# Altium project Soldeerbout.PrjPcb
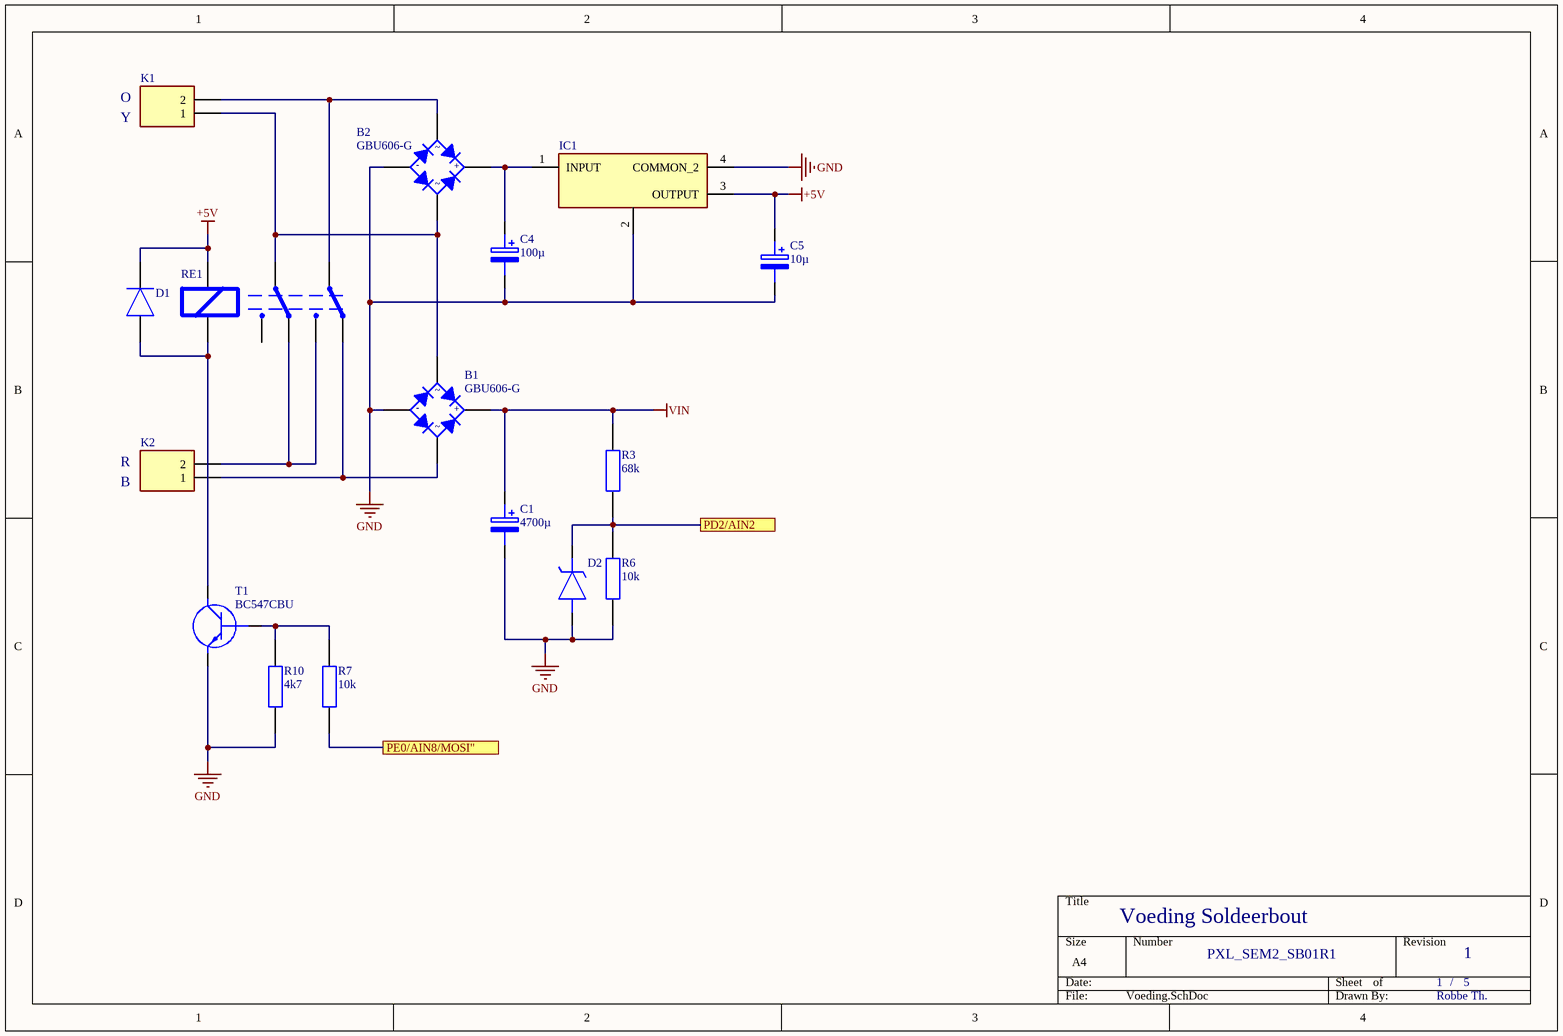
[diagram p0: Voeding.SchDoc]
5 sheets, 74 parts. Net scope: flat (ports and power ports of the same name join across sheets).
Board file: PCB1.PcbDoc
Sheets:
  Voeding.SchDoc
  Heater_Driver.SchDoc
  Temp_Sensing.SchDoc
  Logic.SchDoc
  Display.SchDoc

## Sheet Voeding.SchDoc: Voeding Soldeerbout
size A4; Date: 18/02/2022; Author: Robbe Th.; CompanyName: R-CyberSolutions; DrawnBy: Robbe Th.; Organization: R-CyberSolutions; DocumentNumber: 1/1; Revision: 1; SheetNumber: 1; SheetTotal: 5; Number: PXL_SEM2_SB01R1

### Parts
B1  GBU606-G  [GBU606G]
B2  GBU606-G  [GBU606G]
C1  4700µ  [CAPPRD750W80D1850H4150]
C4  100µ  [CAPPRD350W60D825H1300]
C5  10µ  [CAPPRD200W52D500H1250]
D1  FM4007W-W  [DIOM5025X231N]  (value not drawn)
D2  MMSZ4689T1G  [SOD3716X135N]  (value not drawn)
IC1  TL780-05CKTTR  [TL78005CKTTR]  (value not drawn)
K1  1716020000  [1716020000]  (value not drawn)
K2  1716020000  [1716020000]  (value not drawn)
R3  68k  [RESC2012X65N]
R6  10k  [RESC2012X65N]
R7  10k  [RESC2012X65N]
R10  4k7  [RESC2012X65N]
RE1  RT424005  [RT42]  (value not drawn)
T1  BC547CBU  [BC547CBU]

### Ports
PD2/AIN2, PE0/AIN8/MOSI"

### Nets
+5V: C5.1(+) D1.1(K) IC1.3(OUTPUT) RE1.1(A1_COIL)
GND: B1.4(-) B2.4(-) C1.2(-) C4.2(-) C5.2(-) D2.2(A) IC1.2(COMMON_1) IC1.4(COMMON_2) R6.1 R10.1 T1.3(E)
VIN: B1.1(+) C1.1(+) R3.2
NetB1_2: B1.2 B2.3 K1.1 RE1.3(11_COM)
NetB1_3: B1.3 K2.1 RE1.7(22_NC)
NetB2_1: B2.1(+) C4.1(+) IC1.1(INPUT)
NetB2_2: B2.2 K1.2 RE1.6(21_COM)
NetD1_2: D1.2(A) RE1.8(A2_COIL) T1.1(C)
NetD2_1: D2.1(K) R3.1 R6.2 ; port PD2/AIN2
NetIC3_19: R7.1 ; port PE0/AIN8/MOSI"
NetK2_2: K2.2 RE1.2(12_NC) RE1.5(24_NO)
NetR7_2: R7.2 R10.2 T1.2(B)

Not connected (* = marked no-connect by the designer): RE1 4(14_NO)

### Notes on the sheet
- O
- Y
- R
- B
- /

### Library data of the parts
B1 B2 = GBU606-G: Bridge Rectifier; Manufacturer_Name: Comchip Technology; Datasheet Link: https://www.comchiptech.com/product.php?id=2217; Height: 20.95mm; Manufacturer_Part_Number: GBU606-G; Mouser Part Number: 750-GBU606-G; Mouser Price/Stock: https://www.mouser.co.uk/ProductDetail/Comchip-Technology/GBU606-G?qs=XEIV%2Fho1H6d1WplLbEJ0gw%3D%3D; Arrow Part Number: GBU606-G; Arrow Price/Stock: https://www.arrow.com/en/products/gbu606-g/comchip-technology?region=nac
C1 = 50PK4700MEFC18X40: ELCO 4700 uF; Manufacturer_Name: Rubycon; Datasheet Link: http://www.rubycon.co.jp/en/catalog/e_pdfs/aluminum/e_pk.pdf; Height: 41.5mm; Manufacturer_Part_Number: 50PK4700MEFC18X40; Mouser Part Number: 232-50PK4700MEFC18X4; Mouser Price/Stock: https://www.mouser.co.uk/ProductDetail/Rubycon/50PK4700MEFC18X40?qs=T3oQrply3y8fu7oTpkJ7DA%3D%3D; Arrow Part Number: 50PK4700MEFC18X40; Arrow Price/Stock: https://www.arrow.com/en/products/50pk4700mefc18x40/rubycon
C4 = RGA101M1HBK-0811G: ELCO 100 uF; Manufacturer_Name: Lelon; Datasheet Link: https://www.arrow.com/en/products/rga101m1hbk-0811g/lelon-electronics; Height: 13mm; Manufacturer_Part_Number: RGA101M1HBK-0811G; Mouser Part Number: 140-RGA101M1HBK0811G; Mouser Price/Stock: https://www.mouser.co.uk/ProductDetail/Lelon/RGA101M1HBK-0811G?qs=pNDdEcSXiOBNivHdElCSJA%3D%3D; Arrow Part Number: RGA101M1HBK-0811G; Arrow Price/Stock: https://www.arrow.com/en/products/rga101m1hbk-0811g/lelon-electronics
C5 = 860020672010: ELCO 10 uF; Manufacturer_Name: Wurth Elektronik; Datasheet Link: https://katalog.we-online.de/pbs/datasheet/860020672010.pdf; Height: 12.5mm; Manufacturer_Part_Number: 860020672010; Mouser Part Number: 710-860020672010; Mouser Price/Stock: https://www.mouser.co.uk/ProductDetail/Wurth-Elektronik/860020672010?qs=0KOYDY2FL2%252BaHkqkc1q4lw%3D%3D
D1 = FM4007W-W: Diode 1000V 1A; Manufacturer_Name: Rectron; Datasheet Link: http://www.rectron.com/data_sheets/fm4001w-fm4007w.pdf; Height: 2.31mm; Manufacturer_Part_Number: FM4007W-W; Mouser Part Number: 583-FM4007W-W; Mouser Price/Stock: https://www.mouser.co.uk/ProductDetail/Rectron/FM4007W-W?qs=jY2200qj%252BWCBLCSrfIQtJA%3D%3D; Arrow Part Number: FM4007W-W; Arrow Price/Stock: https://www.arrow.com/en/products/fm4007w-w/rectron?region=nac
D2 = MMSZ4689T1G: Zener Diode; Manufacturer_Name: ON Semiconductor; Datasheet Link: http://www.onsemi.com/pub/Collateral/MMSZ4678T1-D.PDF; Height: 1.35mm; Manufacturer_Part_Number: MMSZ4689T1G; Mouser Part Number: 863-MMSZ4689T1G; Mouser Price/Stock: https://www.mouser.co.uk/ProductDetail/ON-Semiconductor/MMSZ4689T1G/?qs=P4IOph%252Bbot%252Blaz%2FZtdyBaA%3D%3D; Arrow Part Number: MMSZ4689T1G; Arrow Price/Stock: https://www.arrow.com/en/products/mmsz4689t1g/on-semiconductor
IC1 = TL780-05CKTTR: Voltage Regulator 5V; Manufacturer_Name: Texas Instruments; Datasheet Link: http://www.ti.com/general/docs/suppproductinfo.tsp?distId=26&gotoUrl=http%3A%2F%2Fwww.ti.com%2Flit%2Fgpn%2Ftl780; Height: 5.08mm; Manufacturer_Part_Number: TL780-05CKTTR; Mouser Part Number: 595-TL780-05CKTTR; Mouser Price/Stock: https://www.mouser.co.uk/ProductDetail/Texas-Instruments/TL780-05CKTTR?qs=7kv20MEVUlhtPP21hgiOlA%3D%3D; Arrow Part Number: TL780-05CKTTR; Arrow Price/Stock: https://www.arrow.com/en/products/tl780-05ckttr/texas-instruments?region=nac
K1 K2 = 1716020000: Printkroonsteen 2 POL; Manufacturer_Name: Weidmuller; Datasheet Link: https://catalog.weidmueller.com/catalog/Start.do?ObjectID=1716020000&_ga=2.21797499.1716783809.1613378202-511725545.1613378202; Manufacturer_Part_Number: 1716020000; Mouser Part Number: 470-1716020000; Mouser Price/Stock: https://www.mouser.co.uk/ProductDetail/Weidmuller/1716020000?qs=WJDKaGZ8K%252B7GSEFQgvMjVA%3D%3D
R3 R6 R7 R10 = CPF0805B100RE1: Resistor SMD 0805; Manufacturer_Name: TE Connectivity; Datasheet Link: https://datasheet.datasheetarchive.com/originals/distributors/DKDS-21/401696.pdf; Height: 0.65mm; Manufacturer_Part_Number: CPF0805B100RE1; Mouser Part Number: 279-CPF0805B100RE1; Mouser Price/Stock: https://www.mouser.co.uk/ProductDetail/TE-Connectivity-Holsworthy/CPF0805B100RE1?qs=9ylKvqdyudkCWLPT1QvLZQ%3D%3D; Arrow Part Number: CPF0805B100RE1; Arrow Price/Stock: https://www.arrow.com/en/products/cpf0805b100re1/te-connectivity?region=nac
RE1 = RT424005: Contactor; Manufacturer_Name: TE Connectivity; Datasheet Link: https://www.te.com/commerce/DocumentDelivery/DDEController?Action=showdoc&DocId=Data+Sheet%7FRT2%7F1014%7Fpdf%7FEnglish%7FENG_DS_RT2_1014.pdf%7F5-1393243-9; Manufacturer_Part_Number: RT424005; Mouser Part Number: 655-RT424005; Mouser Price/Stock: https://www.mouser.co.uk/ProductDetail/TE-Connectivity-Schrack/RT424005?qs=KKrrU%252BaSadKRsQcVuAjnsQ%3D%3D; Arrow Part Number: RT424005; Arrow Price/Stock: https://www.arrow.com/en/products/rt424005/te-connectivity?region=nac
T1 = BC547CBU: Transistor BJT NPN; Manufacturer_Name: ON Semiconductor; Datasheet Link: https://www.onsemi.com/pdf/datasheet/bc550-d.pdf; Height: 5.33mm; Manufacturer_Part_Number: BC547CBU; Mouser Part Number: 512-BC547CBU; Mouser Price/Stock: https://www.mouser.co.uk/ProductDetail/ON-Semiconductor-Fairchild/BC547CBU/?qs=SpPkH8nd0tbX52Pj0mX5Aw%3D%3D; Arrow Part Number: BC547CBU; Arrow Price/Stock: https://www.arrow.com/en/products/bc547cbu/on-semiconductor?region=nac

## Sheet Heater_Driver.SchDoc: Heater Driver Soldeerbout
size A4; Date: 18/02/2022; Author: Robbe Th.; CompanyName: R-CyberSolutions; DrawnBy: Robbe Th.; Organization: R-CyberSolutions; DocumentNumber: 1/1; Revision: 1; SheetNumber: 2; SheetTotal: 4; Number: PXL_SEM2_SB02R1
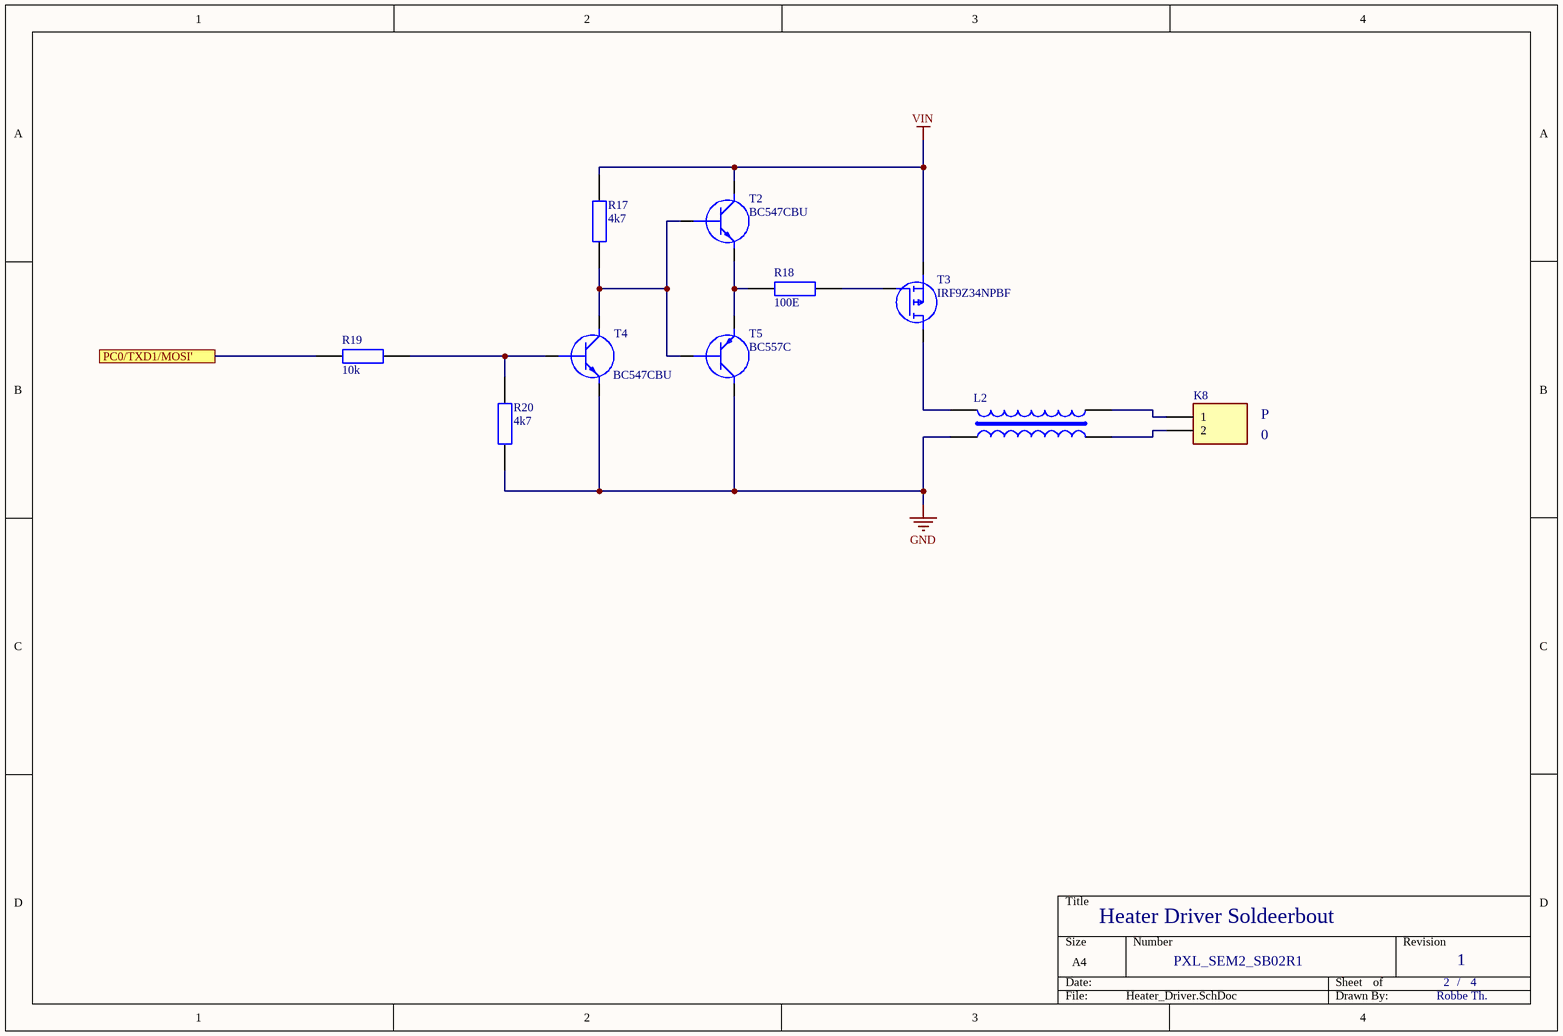
[diagram p1: Heater_Driver.SchDoc]

### Parts
K8  Printkroonsteen 2 POL  [1716020000]  (value not drawn)
L2  CM2545X171B-10  [CM2545X171B10]  (value not drawn)
R17  4k7  [RESC2012X65N]
R18  100E  [RESC2012X65N]
R19  10k  [RESC2012X65N]
R20  4k7  [RESC2012X65N]
T2  BC547CBU  [BC547CBU]
T3  IRF9Z34NPBF  [TO254P469X1042X1967-3P]
T4  BC547CBU  [BC547CBU]
T5  BC557C  [BC557C]

### Ports
PC0/TXD1/MOSI'

### Nets
GND: L2.2(SEC+) R20.1 T4.3(E) T5.3(C)
VIN: R17.2 T2.1(C) T3.2(S)
NetIC3_1: R19.1 ; port PC0/TXD1/MOSI'
NetK8_1: K8.1 L2.4(PRI-)
NetK8_2: K8.2 L2.3(SEC-)
NetL2_1: L2.1(PRI+) T3.3(D)
NetR17_1: R17.1 T2.2(B) T4.1(C) T5.2(B)
NetR18_1: R18.1 T2.3(E) T5.1(E)
NetR18_2: R18.2 T3.1(G)
NetR19_2: R19.2 R20.2 T4.2(B)

### Notes on the sheet
- P
- 0
- /

### Library data of the parts
K8 = 1716020000: Manufacturer_Name: Weidmuller; Datasheet Link: https://catalog.weidmueller.com/catalog/Start.do?ObjectID=1716020000&_ga=2.21797499.1716783809.1613378202-511725545.1613378202; Manufacturer_Part_Number: 1716020000; Mouser Part Number: 470-1716020000; Mouser Price/Stock: https://www.mouser.co.uk/ProductDetail/Weidmuller/1716020000?qs=WJDKaGZ8K%252B7GSEFQgvMjVA%3D%3D
L2 = CM2545X171B-10: Common mode smoorspoel 10A; Manufacturer_Name: Laird Technologies; Datasheet Link: https://datasheet.datasheetarchive.com/originals/dk/DKDS-7/122753.pdf; Height: 9.5mm; Manufacturer_Part_Number: CM2545X171B-10; Mouser Part Number: N/A; Mouser Price/Stock: https://www.mouser.co.uk/ProductDetail/Laird/CM2545X171B-10?qs=PzGy0jfpSMtNfkEypgU65A%3D%3D; Arrow Part Number: CM2545X171B-10; Arrow Price/Stock: https://www.arrow.com/en/products/cm2545x171b-10/laird-technologies
R17-R20 = CPF0805B100RE1: as R3 on sheet Voeding; Datasheet Link: https://datasheet.datasheetarchive.com/originals/distributors/DKDS-21/401696.pdf; Height: 0.65mm; Manufacturer_Part_Number: CPF0805B100RE1; Mouser Part Number: 279-CPF0805B100RE1; Mouser Price/Stock: https://www.mouser.co.uk/ProductDetail/TE-Connectivity-Holsworthy/CPF0805B100RE1?qs=9ylKvqdyudkCWLPT1QvLZQ%3D%3D; Arrow Part Number: CPF0805B100RE1; Arrow Price/Stock: https://www.arrow.com/en/products/cpf0805b100re1/te-connectivity?region=nac
T2 T4 = BC547CBU: as T1 on sheet Voeding; Datasheet Link: https://www.onsemi.com/pdf/datasheet/bc550-d.pdf; Height: 5.33mm; Manufacturer_Part_Number: BC547CBU; Mouser Part Number: 512-BC547CBU; Mouser Price/Stock: https://www.mouser.co.uk/ProductDetail/ON-Semiconductor-Fairchild/BC547CBU/?qs=SpPkH8nd0tbX52Pj0mX5Aw%3D%3D; Arrow Part Number: BC547CBU; Arrow Price/Stock: https://www.arrow.com/en/products/bc547cbu/on-semiconductor?region=nac
T3 = IRF9Z34NPBF: MOSFET (P-Channel); Manufacturer_Name: Infineon; Datasheet Link: https://www.infineon.com/dgdl/irf9z34npbf.pdf?fileId=5546d462533600a40153561220af1ddd; Height: 4.69mm; Manufacturer_Part_Number: IRF9Z34NPBF; Mouser Part Number: 942-IRF9Z34NPBF; Mouser Price/Stock: https://www.mouser.co.uk/ProductDetail/Infineon-IR/IRF9Z34NPBF?qs=9%252BKlkBgLFf16a%2FvlD%252BMCtQ%3D%3D; Arrow Part Number: IRF9Z34NPBF; Arrow Price/Stock: https://www.arrow.com/en/products/irf9z34npbf/infineon-technologies-ag?region=nac
T5 = BC557C: Transistor BJT PNP; Manufacturer_Name: NXP; Datasheet Link: http://uk.rs-online.com/web/p/products/1124775; Height: 5.2mm; Manufacturer_Part_Number: BC557C; Mouser Part Number: 771-BC557C; Mouser Price/Stock: https://www.mouser.co.uk/ProductDetail/NXP-Semiconductors/BC557C?qs=84A%2FDAdkstLO1yR4NjQrgg%3D%3D

## Sheet Temp_Sensing.SchDoc: Temp Sensing Soldeerbout
size A4; DrawnBy: Robbe Th.; Revision: 1; SheetNumber: 3; SheetTotal: 5; Number: PXL_SEM2_SB03R1
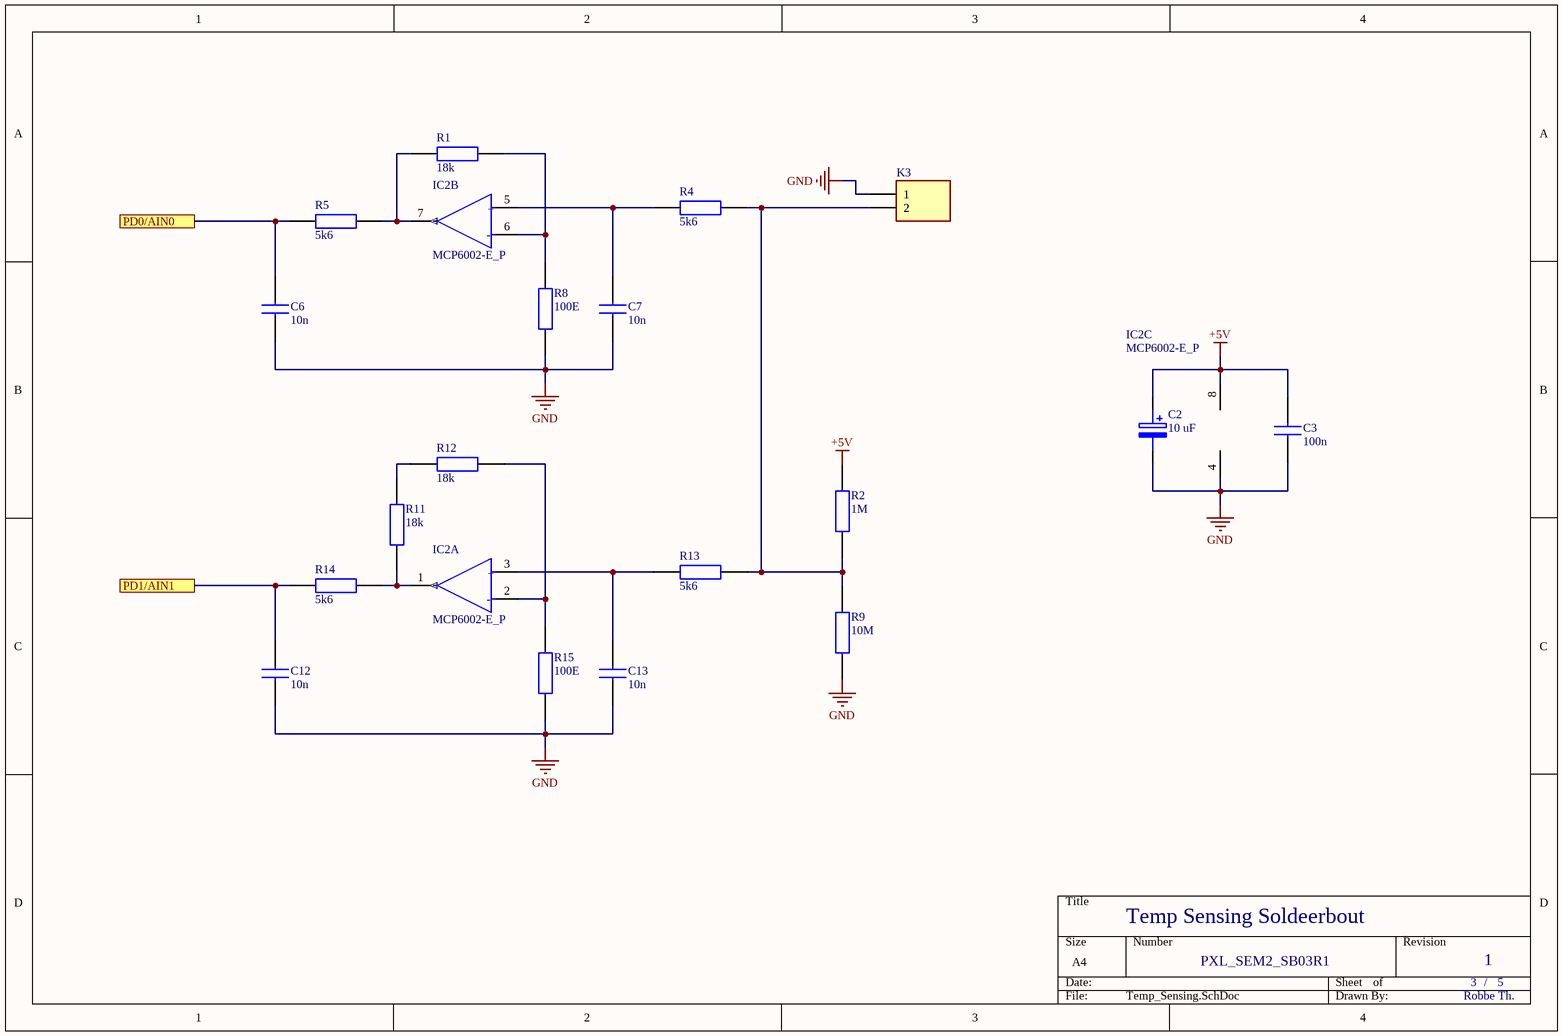
[diagram p2: Temp_Sensing.SchDoc]

### Parts
C2  10 uF  [CAPPRD200W52D500H1250]
C3  100n  [CAPC1005X56N]
C6  10n  [CAPC1005X56N]
C7  10n  [CAPC1005X56N]
C12  10n  [CAPC1005X56N]
C13  10n  [CAPC1005X56N]
IC2  MCP6002-E_P  [DIP781W56P254L950H533Q8N]  (parts A,B,C of 3)
K3  Printkroonsteen 2 POL  [1716020000]  (value not drawn)
R1  18k  [RESC2012X65N]
R2  1M  [RESC2012X65N]
R4  5k6  [RESC2012X65N]
R5  5k6  [RESC2012X65N]
R8  100E  [RESC2012X65N]
R9  10M  [RESC2012X65N]
R11  18k  [RESC2012X65N]
R12  18k  [RESC2012X65N]
R13  5k6  [RESC2012X65N]
R14  5k6  [RESC2012X65N]
R15  100E  [RESC2012X65N]

### Ports
PD0/AIN0, PD1/AIN1

### Nets
+5V: C2.1(+) C3.2 IC2.8(VDD) R2.2
GND: C2.2(-) C3.1 C6.1 C7.1 C12.1 C13.1 IC2.4(VSS) K3.1 R8.1 R9.1 R15.1
NetC6_2: C6.2 R5.1 ; port PD0/AIN0
NetC7_2: C7.2 IC2.5(1IN+) R4.1
NetC12_2: C12.2 R14.1 ; port PD1/AIN1
NetC13_2: C13.2 IC2.3(1IN+) R13.1
NetIC2_1: IC2.1(1OUT) R11.1 R14.2
NetIC2_2: IC2.2(1IN-) R12.2 R15.2
NetIC2_6: IC2.6(1IN-) R1.2 R8.2
NetIC2_7: IC2.7(OUT) R1.1 R5.2
NetK3_2: K3.2 R2.1 R4.2 R9.2 R13.2
NetR11_2: R11.2 R12.1

### Notes on the sheet
- /
- (in symbol MCP6002-E_P, part A) +; -
- (in symbol MCP6002-E_P, part B) +; -

### Library data of the parts
C2 = 860020672010: as C5 on sheet Voeding; Datasheet Link: https://katalog.we-online.de/pbs/datasheet/860020672010.pdf; Height: 12.5mm; Manufacturer_Part_Number: 860020672010; Mouser Part Number: 710-860020672010; Mouser Price/Stock: https://www.mouser.co.uk/ProductDetail/Wurth-Elektronik/860020672010?qs=0KOYDY2FL2%252BaHkqkc1q4lw%3D%3D
C3 C6 C7 C12 C13 = 0402YC104MAT2A: Capacitor SMD 0805; Manufacturer_Name: AVX; Datasheet Link: http://www.mouser.com/catalog/supplier/library/pdf/AVXSurfaceMountCeramic.pdf; Height: 0.56mm; Manufacturer_Part_Number: 0402YC104MAT2A; Mouser Part Number: 581-0402YC104MAT2A; Mouser Price/Stock: https://www.mouser.co.uk/ProductDetail/AVX/0402YC104MAT2A?qs=O2%2FeDh0sX9yiCaLwpXy1bw%3D%3D
IC2 = MCP6002-E_P: Dual OPAMP; Manufacturer_Name: Microchip; Manufacturer_Part_Number: MCP6002-E/P; Datasheet Link: http://componentsearchengine.com/Datasheets/3/MCP6002-E_P.pdf; Height: 5.334mm; Mouser Part Number: 579-MCP6002-E/P; Mouser Price/Stock: https://www.mouser.co.uk/ProductDetail/Microchip-Technology/MCP6002-E-P?qs=hul3WK2zl4pqRWzdnAsu%2FQ%3D%3D; Arrow Part Number: MCP6002-E/P; Arrow Price/Stock: https://www.arrow.com/en/products/mcp6002-ep/microchip-technology?region=nac
K3 = 1716020000: Manufacturer_Name: Weidmuller; Datasheet Link: https://catalog.weidmueller.com/catalog/Start.do?ObjectID=1716020000&_ga=2.21797499.1716783809.1613378202-511725545.1613378202; Manufacturer_Part_Number: 1716020000; Mouser Part Number: 470-1716020000; Mouser Price/Stock: https://www.mouser.co.uk/ProductDetail/Weidmuller/1716020000?qs=WJDKaGZ8K%252B7GSEFQgvMjVA%3D%3D
R1 R2 R4 R5 R8 R9 R11-R15 = CPF0805B100RE1: as R3 on sheet Voeding; Datasheet Link: https://datasheet.datasheetarchive.com/originals/distributors/DKDS-21/401696.pdf; Height: 0.65mm; Manufacturer_Part_Number: CPF0805B100RE1; Mouser Part Number: 279-CPF0805B100RE1; Mouser Price/Stock: https://www.mouser.co.uk/ProductDetail/TE-Connectivity-Holsworthy/CPF0805B100RE1?qs=9ylKvqdyudkCWLPT1QvLZQ%3D%3D; Arrow Part Number: CPF0805B100RE1; Arrow Price/Stock: https://www.arrow.com/en/products/cpf0805b100re1/te-connectivity?region=nac

## Sheet Logic.SchDoc: Logic Soldeerbout
size A4; DrawnBy: Robbe Th.; Revision: 1; SheetNumber: 4; SheetTotal: 5; Number: PXL_SEM2_SB04R1
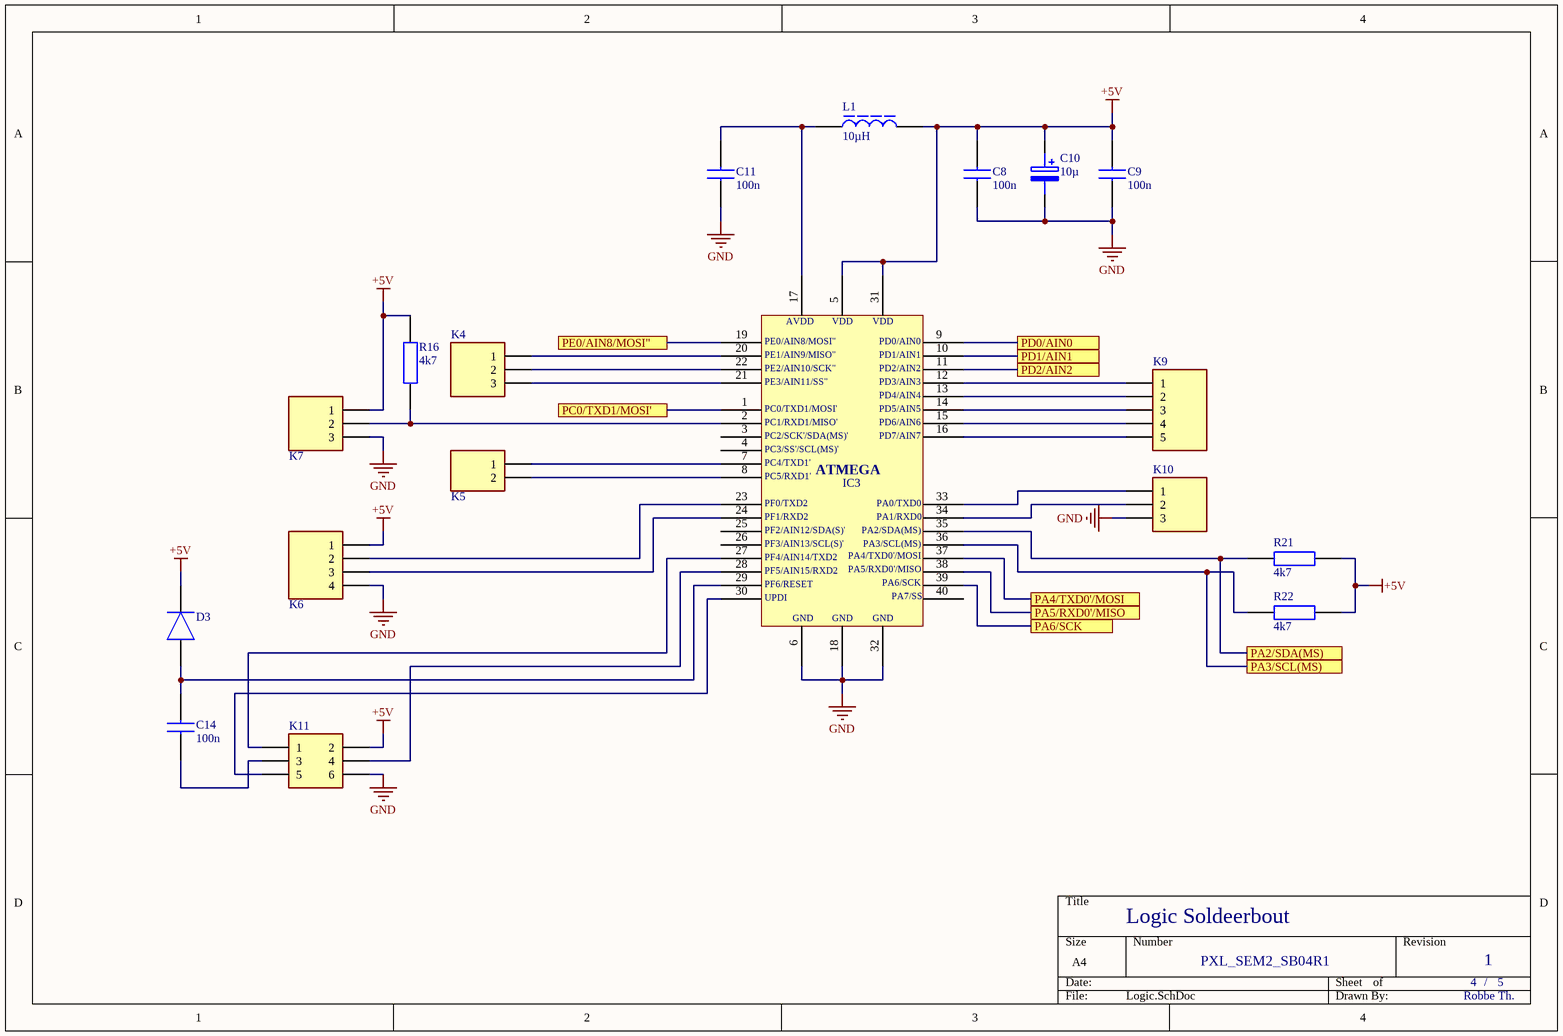
[diagram p3: Logic.SchDoc]

### Parts
C8  100n  [CAPC1005X56N]
C9  100n  [CAPC1005X56N]
C10  10µ  [CAPPRD200W52D500H1250]
C11  100n  [CAPC1005X56N]
C14  100n  [CAPC1005X56N]
D3  SMMDL914T11NG  [SOD2512X110N]  (value not drawn)
IC3  ATMEGA4809-PF  [DIP1543W58P254L5175H635Q40N]  (value not drawn)
K4  M20-9990345  [HDRV3W64P0X254_1X3_762X254X864P]  (value not drawn)
K5  M20-9990246  [HDRV2W66P0X254_1X2_508X254X874P]  (value not drawn)
K6  M20-9770446  [HDRV4W64P0X254_1X4_1016X254X834P]  (value not drawn)
K7  M20-9990345  [HDRV3W64P0X254_1X3_762X254X864P]  (value not drawn)
K9  M20-9990545  [HDRV5W64P0X254_1X5_1270X254X864P]  (value not drawn)
K10  M20-9990345  [HDRV3W64P0X254_1X3_762X254X864P]  (value not drawn)
K11  M20-9760342  [HDRV6W66P254_2X3_762X508X830P]  (value not drawn)
L1  10µH  [VLS6045]
R16  4k7  [RESC2012X65N]
R21  4k7  [RESC2012X65N]
R22  4k7  [RESC2012X65N]

### Ports
PA2/SDA(MS), PA3/SCL(MS), PA4/TXD0'/MOSI, PA5/RXD0'/MISO, PA6/SCK, PC0/TXD1/MOSI', PD0/AIN0, PD1/AIN1, PD2/AIN2, PE0/AIN8/MOSI"

### Nets
+5V: C8.2 C9.2 C10.1(+) D3.1(K) IC3.5 IC3.31 K6.1 K7.1 K11.2 L1.2 R16.2 R21.2 R22.2
GND: C8.1 C9.1 C10.2(-) C11.1 IC3.6 IC3.18 IC3.32 K6.4 K7.3 K10.3 K11.6
NetC6_2: IC3.9 ; port PD0/AIN0
NetC11_2: C11.2 IC3.17 L1.1
NetC12_2: IC3.10 ; port PD1/AIN1
NetC14_1: C14.1 K11.3
NetC14_2: C14.2 D3.2(A) IC3.29
NetC15_1: IC3.38 ; port PA5/RXD0'/MISO
NetC16_1: IC3.39 ; port PA6/SCK
NetC17_1: IC3.37 ; port PA4/TXD0'/MOSI
NetD2_1: IC3.11 ; port PD2/AIN2
NetIC3_1: IC3.1 ; port PC0/TXD1/MOSI'
NetIC3_2: IC3.2 K7.2 R16.1
NetIC3_7: IC3.7 K5.1
NetIC3_8: IC3.8 K5.2
NetIC3_12: IC3.12 K9.1
NetIC3_13: IC3.13 K9.2
NetIC3_14: IC3.14 K9.3
NetIC3_15: IC3.15 K9.4
NetIC3_16: IC3.16 K9.5
NetIC3_19: IC3.19 ; port PE0/AIN8/MOSI"
NetIC3_20: IC3.20 K4.1
NetIC3_21: IC3.21 K4.3
NetIC3_22: IC3.22 K4.2
NetIC3_23: IC3.23 K6.2
NetIC3_24: IC3.24 K6.3
NetIC3_27: IC3.27 K11.1
NetIC3_28: IC3.28 K11.4
NetIC3_30: IC3.30 K11.5
NetIC3_33: IC3.33 K10.1
NetIC3_34: IC3.34 K10.2
NetIC3_35: IC3.35 R21.1 ; port PA2/SDA(MS)
NetIC3_36: IC3.36 R22.1 ; port PA3/SCL(MS)

Not connected (* = marked no-connect by the designer): IC3 3 4 25 26 40

### Notes on the sheet
- /
- (in symbol ATMEGA4809-PF) AVDD; VDD; PE0/AIN8/MOSI"; PD0/AIN0; PE1/AIN9/MISO"; PD1/AIN1; PE2/AIN10/SCK"; PD2/AIN2; PE3/AIN11/SS"; PD3/AIN3; PD4/AIN4; PC0/TXD1/MOSI'; PD5/AIN5; PC1/RXD1/MISO'; PD6/AIN6; PC2/SCK'/SDA(MS)'; PD7/AIN7; PC3/SS'/SCL(MS)'; PC4/TXD1'; ATMEGA; PC5/RXD1'; PF0/TXD2; PA0/TXD0; PF1/RXD2; PA1/RXD0; PF2/AIN12/SDA(S)'; PA2/SDA(MS); PF3/AIN13/SCL(S)'; PA3/SCL(MS); PF4/AIN14/TXD2; PA4/TXD0'/MOSI; PF5/AIN15/RXD2; PA5/RXD0'/MISO; PF6/RESET; PA6/SCK; UPDI; PA7/SS; GND

### Library data of the parts
C8 C9 C11 C14 = 0402YC104MAT2A: as C3 on sheet Temp_Sensing; Datasheet Link: http://www.mouser.com/catalog/supplier/library/pdf/AVXSurfaceMountCeramic.pdf; Height: 0.56mm; Manufacturer_Part_Number: 0402YC104MAT2A; Mouser Part Number: 581-0402YC104MAT2A; Mouser Price/Stock: https://www.mouser.co.uk/ProductDetail/AVX/0402YC104MAT2A?qs=O2%2FeDh0sX9yiCaLwpXy1bw%3D%3D
C10 = 860020672010: as C5 on sheet Voeding; Datasheet Link: https://katalog.we-online.de/pbs/datasheet/860020672010.pdf; Height: 12.5mm; Manufacturer_Part_Number: 860020672010; Mouser Part Number: 710-860020672010; Mouser Price/Stock: https://www.mouser.co.uk/ProductDetail/Wurth-Elektronik/860020672010?qs=0KOYDY2FL2%252BaHkqkc1q4lw%3D%3D
D3 = SMMDL914T1G: Diode 100V 200mA 4ns; Manufacturer_Name: ON Semiconductor; Datasheet Link: https://www.onsemi.com/pub/Collateral/MMDL914T1-D.PDF; Height: 1.1mm; Manufacturer_Part_Number: SMMDL914T1G; Mouser Part Number: 863-SMMDL914T1G; Mouser Price/Stock: https://www.mouser.co.uk/ProductDetail/onsemi/SMMDL914T1G?qs=3PKVEWFFm2%252B2VboGvGtVUg%3D%3D; Arrow Part Number: SMMDL914T1G; Arrow Price/Stock: https://www.arrow.com/en/products/smmdl914t1g/on-semiconductor
IC3 = ATMEGA4809-PF: 8-bit MCU; Manufacturer_Name: Microchip; Datasheet Link: http://ww1.microchip.com/downloads/en/DeviceDoc/40-pin-Data-Sheet-megaAVR-0-series-DS40002104A.pdf; Height: 6.35mm; Manufacturer_Part_Number: ATMEGA4809-PF; Mouser Part Number: 556-ATMEGA4809-PF; Mouser Price/Stock: https://www.mouser.co.uk/ProductDetail/Microchip-Technology-Atmel/ATMEGA4809-PF?qs=T3oQrply3y9UlpZbCygk%252BQ%3D%3D
K4 K7 K10 = M20-9990345: 1R 3P Connector; Manufacturer_Name: Harwin; Datasheet Link: https://cdn.harwin.com/pdfs/M20-999.pdf; Height: 8.64mm; Manufacturer_Part_Number: M20-9990345; Mouser Part Number: 855-M20-9990345; Mouser Price/Stock: https://www.mouser.co.uk/ProductDetail/Harwin/M20-9990345?qs=ulE8k0yEMYbl6ZPCtNdmpA%3D%3D
K5 = M20-9990246: 1R 2P Connector; Manufacturer_Name: Harwin; Datasheet Link: https://cdn.harwin.com/pdfs/M20-999.pdf; Height: 8.74mm; Manufacturer_Part_Number: M20-9990246; Mouser Part Number: 855-M20-9990246; Mouser Price/Stock: https://www.mouser.co.uk/ProductDetail/Harwin/M20-9990246?qs=Jph8NoUxIfWjw4WmyRvzag%3D%3D
K6 = M20-9770446: 1R 4P Connector; Manufacturer_Name: Harwin; Datasheet Link: https://componentsearchengine.com/Datasheets/1/M20-9770446.pdf; Height: 8.34mm; Manufacturer_Part_Number: M20-9770446; Mouser Part Number: 855-M20-9770446; Mouser Price/Stock: https://www.mouser.co.uk/ProductDetail/Harwin/M20-9770446?qs=ulE8k0yEMYbCPpMPHeYh4w%3D%3D
K9 = M20-9990545: 1R 5P Connector; Manufacturer_Name: Harwin; Datasheet Link: https://componentsearchengine.com/Datasheets/2/M20-9990545.pdf; Height: 8.64mm; Manufacturer_Part_Number: M20-9990545; Mouser Part Number: 855-M20-9990545; Mouser Price/Stock: https://www.mouser.co.uk/ProductDetail/Harwin/M20-9990545?qs=ulE8k0yEMYY1AaFSSzjXzw%3D%3D
K11 = M20-9760342: 2R 6P Connector; Manufacturer_Name: Harwin; Datasheet Link: https://cdn.harwin.com/pdfs/M20-976.pdf; Height: 8.3mm; Manufacturer_Part_Number: M20-9760342; Mouser Part Number: 855-M20-9760342; Mouser Price/Stock: https://www.mouser.co.uk/ProductDetail/Harwin/M20-9760342/?qs=%252Bk6%2F5FB6qrkaVmYIHZO6zg%3D%3D
L1 = VLS6045EX-100M-H: Smoorspoel 10uH; Manufacturer_Name: TDK; Datasheet Link: https://product.tdk.com/system/files/dam/doc/product/inductor/inductor/smd/catalog/inductor_automotive_power_vls6045ex-h_en.pdf; Manufacturer_Part_Number: VLS6045EX-100M-H; Mouser Part Number: 810-VLS6045EX-100M-H; Mouser Price/Stock: https://www.mouser.co.uk/ProductDetail/TDK/VLS6045EX-100M-H?qs=qSfuJ%252Bfl%2Fd6r84tw2EUg2Q%3D%3D; Arrow Part Number: VLS6045EX-100M-H; Arrow Price/Stock: https://www.arrow.com/en/products/vls6045ex-100m-h/tdk?region=nac
R16 R21 R22 = CPF0805B100RE1: as R3 on sheet Voeding; Datasheet Link: https://datasheet.datasheetarchive.com/originals/distributors/DKDS-21/401696.pdf; Height: 0.65mm; Manufacturer_Part_Number: CPF0805B100RE1; Mouser Part Number: 279-CPF0805B100RE1; Mouser Price/Stock: https://www.mouser.co.uk/ProductDetail/TE-Connectivity-Holsworthy/CPF0805B100RE1?qs=9ylKvqdyudkCWLPT1QvLZQ%3D%3D; Arrow Part Number: CPF0805B100RE1; Arrow Price/Stock: https://www.arrow.com/en/products/cpf0805b100re1/te-connectivity?region=nac

## Sheet Display.SchDoc: Display Soldeerbout
size A4; DrawnBy: Robbe Th.; Revision: 1; SheetNumber: 5; SheetTotal: 5; Number: PXL_SEM2_SB05R1
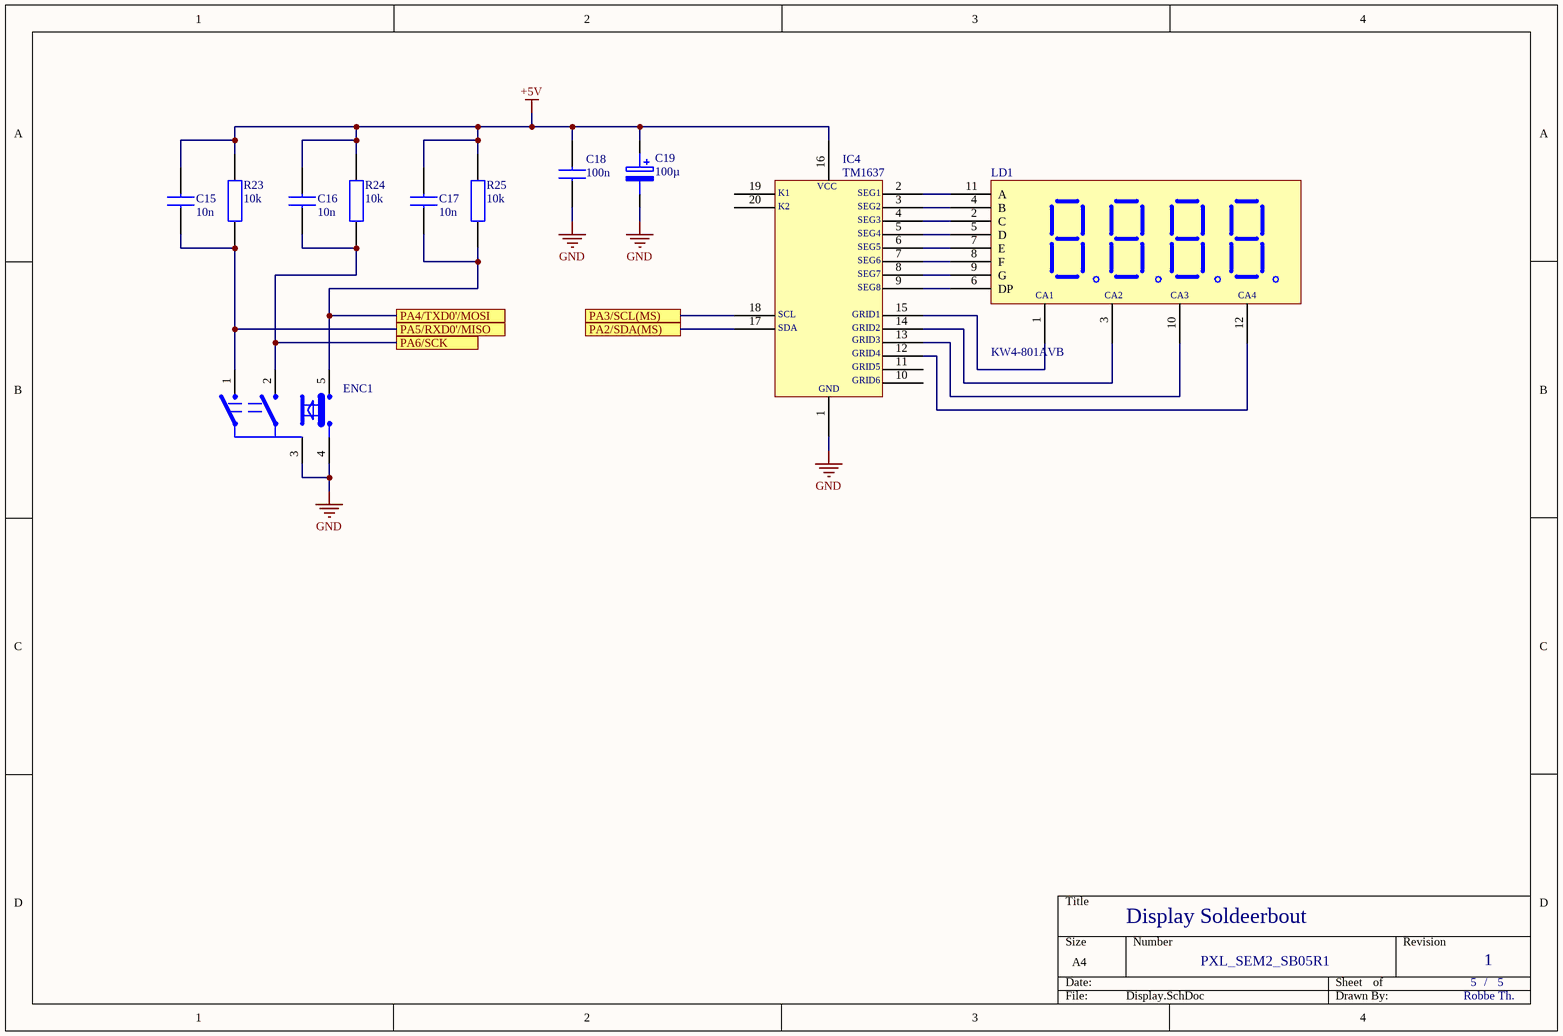
[diagram p4: Display.SchDoc]

### Parts
C15  10n  [CAPC1005X56N]
C16  10n  [CAPC1005X56N]
C17  10n  [CAPC1005X56N]
C18  100n  [CAPC1005X56N]
C19  100µ  [CAPPRD350W60D825H1300]
ENC1  PEC11R-4225F-S0024  [PEC12R-4XXXF-SXXXX_1]  (value not drawn)
IC4  TM1637  [SOIC127P1045X280-20N]
LD1  KW4-801AVB  [KW4-801AVB-FP]
R23  10k  [RESC2012X65N]
R24  10k  [RESC2012X65N]
R25  10k  [RESC2012X65N]

### Ports
PA2/SDA(MS), PA3/SCL(MS), PA4/TXD0'/MOSI, PA5/RXD0'/MISO, PA6/SCK

### Nets
+5V: C15.2 C16.2 C17.2 C18.2 C19.1(+) IC4.16 R23.2 R24.2 R25.2
GND: C18.1 C19.2(-) ENC1.3 ENC1.4 IC4.1
NetC15_1: C15.1 ENC1.1 R23.1 ; port PA5/RXD0'/MISO
NetC16_1: C16.1 ENC1.2 R24.1 ; port PA6/SCK
NetC17_1: C17.1 ENC1.5 R25.1 ; port PA4/TXD0'/MOSI
NetIC3_35: IC4.17 ; port PA2/SDA(MS)
NetIC3_36: IC4.18 ; port PA3/SCL(MS)
NetIC4_2: IC4.2 LD1.11(A)
NetIC4_3: IC4.3 LD1.4(B)
NetIC4_4: IC4.4 LD1.2(C)
NetIC4_5: IC4.5 LD1.5(D)
NetIC4_6: IC4.6 LD1.7(E)
NetIC4_7: IC4.7 LD1.8(F)
NetIC4_8: IC4.8 LD1.9(G)
NetIC4_9: IC4.9 LD1.6(DP)
NetIC4_12: IC4.12 LD1.12
NetIC4_13: IC4.13 LD1.10
NetIC4_14: IC4.14 LD1.3
NetIC4_15: IC4.15 LD1.1(CA1)

Not connected (* = marked no-connect by the designer): IC4 10 11 19 20

### Notes on the sheet
- /
- (in symbol KW4-801AVB) CA2; CA3; CA4
- (in symbol TM1637) VCC; K1; SEG1; K2; SEG2; SEG3; SEG4; SEG5; SEG6; SEG7; SEG8; SCL; GRID1; SDA; GRID2; GRID3; GRID4; GRID5; GRID6; GND

### Library data of the parts
C15-C18 = 0402YC104MAT2A: as C3 on sheet Temp_Sensing; Datasheet Link: http://www.mouser.com/catalog/supplier/library/pdf/AVXSurfaceMountCeramic.pdf; Height: 0.56mm; Manufacturer_Part_Number: 0402YC104MAT2A; Mouser Part Number: 581-0402YC104MAT2A; Mouser Price/Stock: https://www.mouser.co.uk/ProductDetail/AVX/0402YC104MAT2A?qs=O2%2FeDh0sX9yiCaLwpXy1bw%3D%3D
C19 = RGA101M1HBK-0811G: ELCO 100 uF; Manufacturer_Name: Lelon; Datasheet Link: https://www.arrow.com/en/products/rga101m1hbk-0811g/lelon-electronics; Height: 13mm; Manufacturer_Part_Number: RGA101M1HBK-0811G; Mouser Part Number: 140-RGA101M1HBK0811G; Mouser Price/Stock: https://www.mouser.co.uk/ProductDetail/Lelon/RGA101M1HBK-0811G?qs=pNDdEcSXiOBNivHdElCSJA%3D%3D; Arrow Part Number: RGA101M1HBK-0811G; Arrow Price/Stock: https://www.arrow.com/en/products/rga101m1hbk-0811g/lelon-electronics
ENC1 = PEC11R-4225F-S0024: Rotary Button; Manufacturer_Name: Bourns; Datasheet Link: https://componentsearchengine.com/Datasheets/1/PEC11R-4225F-S0024.pdf; Manufacturer_Part_Number: PEC11R-4225F-S0024; Mouser Part Number: 652-PEC11R-4225F-S24; Mouser Price/Stock: https://www.mouser.co.uk/ProductDetail/Bourns/PEC11R-4225F-S0024?qs=Zq5ylnUbLm4N6UNkPX3pkQ%3D%3D; Arrow Part Number: PEC11R-4225F-S0024; Arrow Price/Stock: https://www.arrow.com/en/products/pec11r-4225f-s0024/bourns?region=nac
IC4 = TM1637: Driver LED Display; Manufacturer_Name: TITAN MICRO ELECTRONICS; Manufacturer_Part_Number: TM1637 (SOP); Datasheet Link: https://www.mcielectronics.cl/website_MCI/static/documents/Datasheet_TM1637.pdf; Height: 2.8mm
LD1 = KW4-801AVB: 4-Digit LED Display
R23-R25 = CPF0805B100RE1: as R3 on sheet Voeding; Datasheet Link: https://datasheet.datasheetarchive.com/originals/distributors/DKDS-21/401696.pdf; Height: 0.65mm; Manufacturer_Part_Number: CPF0805B100RE1; Mouser Part Number: 279-CPF0805B100RE1; Mouser Price/Stock: https://www.mouser.co.uk/ProductDetail/TE-Connectivity-Holsworthy/CPF0805B100RE1?qs=9ylKvqdyudkCWLPT1QvLZQ%3D%3D; Arrow Part Number: CPF0805B100RE1; Arrow Price/Stock: https://www.arrow.com/en/products/cpf0805b100re1/te-connectivity?region=nac

## Nets that join several sheets
+5V: Voeding (C5.1 D1.1 IC1.3 RE1.1), Temp_Sensing (C2.1 C3.2 IC2.8 R2.2), Logic (13 pins), Display (9 pins)
GND: Voeding (11 pins), Heater_Driver (L2.2 R20.1 T4.3 T5.3), Temp_Sensing (11 pins), Logic (11 pins), Display (5 pins)
VIN: Voeding (B1.1 C1.1 R3.2), Heater_Driver (R17.2 T2.1 T3.2)
NetC6_2: Temp_Sensing (C6.2 R5.1), Logic (IC3.9)
NetC12_2: Temp_Sensing (C12.2 R14.1), Logic (IC3.10)
NetC15_1: Logic (IC3.38), Display (C15.1 ENC1.1 R23.1)
NetC16_1: Logic (IC3.39), Display (C16.1 ENC1.2 R24.1)
NetC17_1: Logic (IC3.37), Display (C17.1 ENC1.5 R25.1)
NetD2_1: Voeding (D2.1 R3.1 R6.2), Logic (IC3.11)
NetIC3_1: Heater_Driver (R19.1), Logic (IC3.1)
NetIC3_19: Voeding (R7.1), Logic (IC3.19)
NetIC3_35: Logic (IC3.35 R21.1), Display (IC4.17)
NetIC3_36: Logic (IC3.36 R22.1), Display (IC4.18)